# EAGLE design FE1-1S (EAGLE 8.5.2)
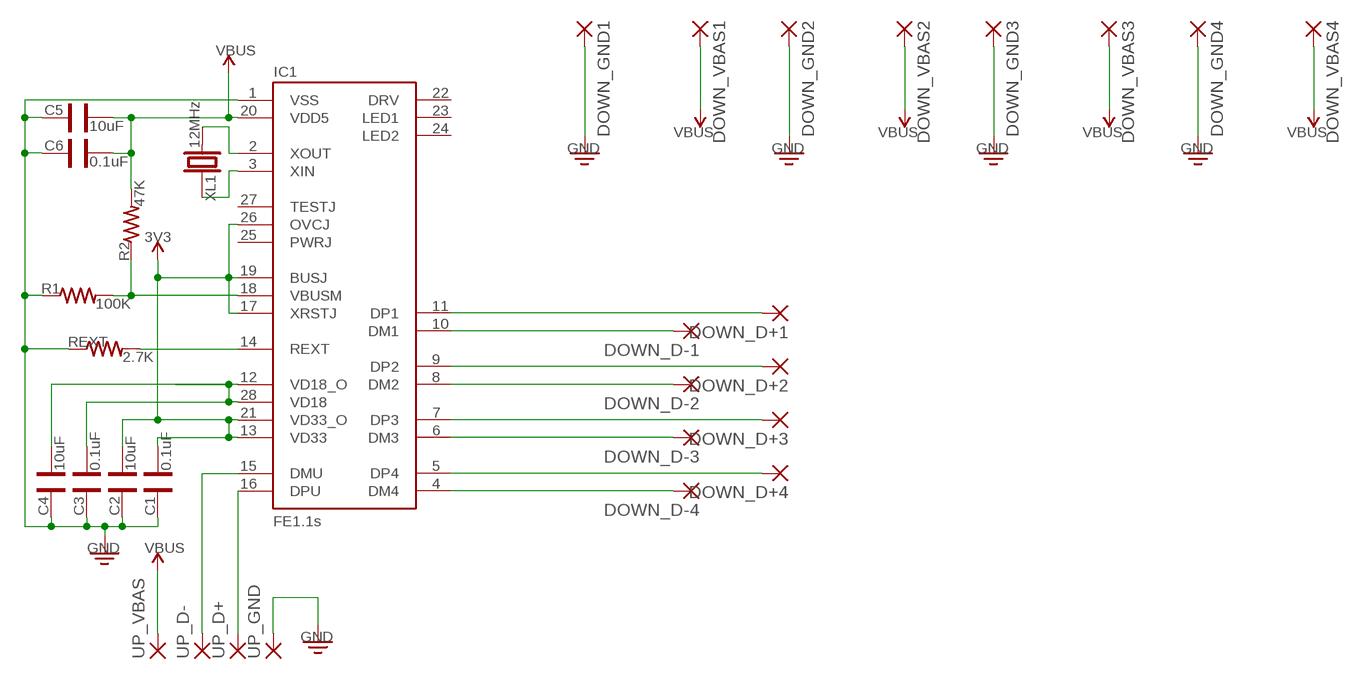
[diagram p0: schematic, sheet 1]

## Parts
C1  0.1uF  CAP0603  [CAP-0603]
C2  10uF  CAP0603  [CAP-0603]
C3  0.1uF  CAP0603  [CAP-0603]
C4  10uF  CAP0603  [CAP-0603]
C5  10uF  CAP0603  [CAP-0603]
C6  0.1uF  CAP0603  [CAP-0603]
DOWN_D+1  SMD2  [SMD1,27-2,54]
DOWN_D+2  SMD2  [SMD1,27-2,54]
DOWN_D+3  SMD2  [SMD1,27-2,54]
DOWN_D+4  SMD2  [SMD1,27-2,54]
DOWN_D-1  SMD2  [SMD1,27-2,54]
DOWN_D-2  SMD2  [SMD1,27-2,54]
DOWN_D-3  SMD2  [SMD1,27-2,54]
DOWN_D-4  SMD2  [SMD1,27-2,54]
DOWN_GND1  SMD2  [SMD1,27-2,54]
DOWN_GND2  SMD2  [SMD1,27-2,54]
DOWN_GND3  SMD2  [SMD1,27-2,54]
DOWN_GND4  SMD2  [SMD1,27-2,54]
DOWN_VBAS1  SMD2  [SMD1,27-2,54]
DOWN_VBAS2  SMD2  [SMD1,27-2,54]
DOWN_VBAS3  SMD2  [SMD1,27-2,54]
DOWN_VBAS4  SMD2  [SMD1,27-2,54]
IC1  FE1.1S  [FE1.1S_SSOP-28]
R1  100K  RES0603  [RES-0603]
R2  47K  RES0603  [RES-0603]
REXT  2.7K  RES0603  [RES-0603]
UP_D+  SMD2  [SMD1,27-2,54]
UP_D-  SMD2  [SMD1,27-2,54]
UP_GND  SMD2  [SMD1,27-2,54]
UP_VBAS  SMD2  [SMD1,27-2,54]
XL1  12MHz  CRYSTALHC49S  [HC49S]

## Nets
3V3: C1.1 C2.1 IC1.13(VD33) IC1.17(XRSTJ) IC1.19(BUSJ) IC1.21(VD33_O) IC1.26(OVCJ)
DD+1: DOWN_D+1.1(P) IC1.11(DP1)
DD+2: DOWN_D+2.1(P) IC1.9(DP2)
DD+3: DOWN_D+3.1(P) IC1.7(DP3)
DD+4: DOWN_D+4.1(P) IC1.5(DP4)
DD-1: DOWN_D-1.1(P) IC1.10(DM1)
DD-2: DOWN_D-2.1(P) IC1.8(DM2)
DD-3: DOWN_D-3.1(P) IC1.6(DM3)
DD-4: DOWN_D-4.1(P) IC1.4(DM4)
GND: C1.2 C2.2 C3.2 C4.2 C5.2 C6.2 DOWN_GND1.1(P) DOWN_GND2.1(P) DOWN_GND3.1(P) DOWN_GND4.1(P) IC1.1(VSS) R1.1 REXT.1 UP_GND.1(P)
N$1: IC1.14(REXT) REXT.2
N$2: IC1.15(DMU) UP_D-.1(P)
N$3: IC1.16(DPU) UP_D+.1(P)
N$7: IC1.2(XOUT) XL1.2
N$8: C3.1 C4.1 IC1.12(VD18_O) IC1.28(VD18)
N$9: IC1.3(XIN) XL1.1
N$13: IC1.18(VBUSM) R1.2 R2.1
VBUS: C5.1 C6.1 DOWN_VBAS1.1(P) DOWN_VBAS2.1(P) DOWN_VBAS3.1(P) DOWN_VBAS4.1(P) IC1.20(VDD5) R2.2 UP_VBAS.1(P)
Unconnected: IC1.22(DRV) IC1.23(LED1) IC1.24(LED2) IC1.25(PWRJ) IC1.27(TESTJ)

## Library data of the parts
C1-C6 = Ai_Passives:CAP
DOWN_D+1-DOWN_D+4 DOWN_D-1-DOWN_D-4 DOWN_GND1-DOWN_GND4 DOWN_VBAS1-DOWN_VBAS4 UP_D+ UP_D- UP_GND UP_VBAS = wirepad:SMD2: SMD PAD
IC1 = Ai_IC:FE1.1S
R1 R2 REXT = Ai_Passives:RES: Part # blah Digikey
XL1 = Ai_FrequencyControl:CRYSTAL: PTH: ... SMD: ... Cylinder: CMR200T-32.768KDZBT

## Board
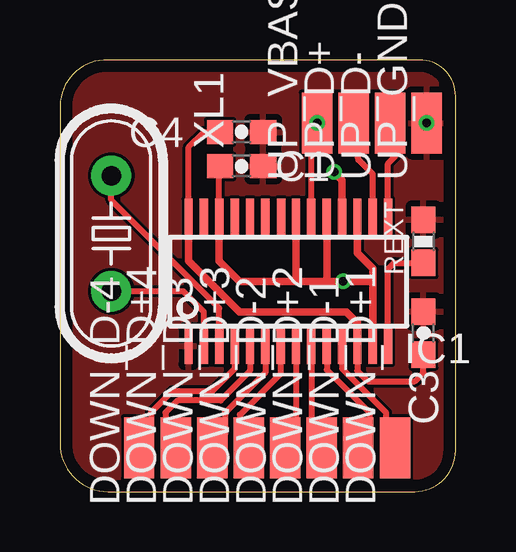
[diagram p1: board, top side]
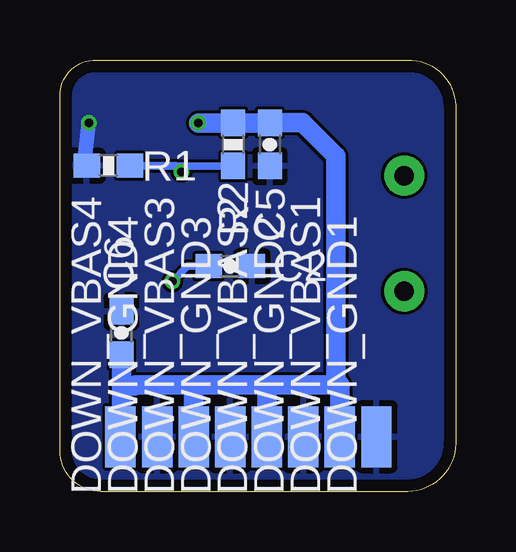
[diagram p2: board, bottom side, seen from below]

Size 16.5 x 18 mm. Coordinates in mm from the lower left corner, seen from the top.
Outline: 0,2 arc90 2,0 14.8,0 arc90 16.5,1.7 16.5,16.5 arc90 15,18 2,18 arc90 0,16.1 0,2
Copper layers (1*16): Top 0.035mm / dielectric 1.53mm / Bottom 0.035mm
Design rules "pban_5mil-l2": minimum track width 5mil, minimum drill 0.3mm, track to track 5mil, track to pad 0.229mm, pad to pad 5mil, via to via 5mil, smd to smd 5mil, copper to edge 0.5mm, drill to drill 0.5mm, minimum pad ring 0.15mm, minimum via ring 0.15mm, stop-mask expansion 4mil, vias tented up to drill 0.35mm, thermal gap 10mil

### Footprints (pad centres in the part's own frame; a part is rotated, then mirrored left to right if it is on the bottom)
CAP-0603 = smd 1.1 x 1: 1 -0.9,0; 2 0.9,0
SMD1,27-2,54 = smd 1.27 x 2.54: 1 0,0
FE1.1S_SSOP-28 = smd 0.35 x 1.5: 1 -4.16,-2.7; 2 -3.52,-2.7; 3 -2.88,-2.7; 4 -2.24,-2.7; 5 -1.6,-2.7; 6 -0.96,-2.7; 7 -0.32,-2.7; 8 0.32,-2.7; 9 0.96,-2.7; 10 1.6,-2.7; 11 2.24,-2.7; 12 2.88,-2.7; 13 3.52,-2.7; 14 4.16,-2.7; 15 4.16,2.7; 16 3.52,2.7; 17 2.88,2.7; 18 2.24,2.7; 19 1.6,2.7; 20 0.96,2.7; 21 0.32,2.7; 22 -0.3,2.7; 23 -0.96,2.7; 24 -1.6,2.7; 25 -2.24,2.7; 26 -2.88,2.7; 27 -3.52,2.7; 28 -4.16,2.7
RES-0603 = smd 1.1 x 1: 1 -0.9,0; 2 0.9,0
HC49S = drill 0.813 pad 1.676: 1 -2.413,0; 2 2.413,0

### Placement (x,y rotation side)
C1  7.58,13.57 0 top
C2  9.4,9.4 0 bottom
C3  15.16,6.61 90 top
C4  7.58,14.99 0 top
C5  7.75,14.48 270 bottom
C6  13.93,6.61 90 bottom
DOWN_D+1  13.97,1.82 0 top
DOWN_D+2  10.92,1.82 0 top
DOWN_D+3  7.87,1.82 0 top
DOWN_D+4  4.83,1.82 0 top
DOWN_D-1  12.45,1.82 0 top
DOWN_D-2  9.4,1.82 0 top
DOWN_D-3  6.35,1.82 0 top
DOWN_D-4  3.3,1.82 0 top
DOWN_GND1  3.3,2.29 0 bottom
DOWN_GND2  6.35,2.29 0 bottom
DOWN_GND3  9.4,2.29 0 bottom
DOWN_GND4  12.45,2.29 0 bottom
DOWN_VBAS1  4.83,2.29 0 bottom
DOWN_VBAS2  7.87,2.29 0 bottom
DOWN_VBAS3  10.92,2.29 0 bottom
DOWN_VBAS4  13.97,2.29 0 bottom
IC1  9.53,8.76 0 top
R1  14.48,13.59 0 bottom
R2  9.27,14.48 90 bottom
REXT  15.16,10.44 270 top
UP_D+  12.25,15.37 0 top
UP_D-  13.77,15.37 0 top
UP_GND  15.29,15.37 0 top
UP_VBAS  10.72,15.37 0 top
XL1  2.14,10.76 270 top

### Tracks (layer width: path | path; a pad name or v marks a point on that pad's centre or on a via)
3V3  (via drill 0.35)
  Top 0.254: IC1.26 6.64,13.14 C1.1
  Top 0.305: IC1.13 13.04,8.76 | 13.04,8.76 13.04,9.31 12.4,9.95 IC1.17 | IC1.26 6.64,9.61 7.49,8.76 9.91,8.76 | 9.91,8.76 11.18,8.76 | 11.18,8.76 v11.81,8.76 13.04,8.76 | IC1.21 9.85,8.82 9.91,8.76 | IC1.19 11.12,8.81 11.18,8.76
  Bottom 0.305: C2.1 11.18,9.4 v11.81,8.76
DD+1
  Top 0.254: IC1.11 11.77,5.13 13.6,3.3 13.6,2.19 DOWN_D+1.1
DD+2
  Top 0.254: IC1.9 10.48,2.26 DOWN_D+2.1
DD+3
  Top 0.254: IC1.7 9.21,4.91 7.5,3.2 7.5,2.2 DOWN_D+3.1
DD+4
  Top 0.254: IC1.5 7.92,5.03 6.7,3.8 4.9,3.8 4.4,3.3 4.4,2.25 DOWN_D+4.1
DD-1
  Top 0.254: IC1.10 11.12,5.08 12.9,3.3 12.9,2.28 DOWN_D-1.1
DD-2
  Top 0.254: IC1.8 9.85,2.27 DOWN_D-2.1
DD-3
  Top 0.254: IC1.6 8.56,4.96 6.88,3.28 6.88,2.36 DOWN_D-3.1
DD-4
  Top 0.254: IC1.4 7.29,5.12 6.34,4.18 4.68,4.18 3.8,3.3 3.8,2.32 DOWN_D-4.1
GND  (via drill 0.35)
  Bottom 0.61: UP_GND.1 15.49,13.71 R1.1
  other vias: 15.29,15.37
  pour Top: -3.81,-3.81 -3.81,22.86 21.59,22.86 25.4,22.86 25.4,-5.08 -3.81,-5.08
  pour Bottom: -2.54,-5.08 24.13,-5.08 24.13,22.86 -2.54,22.86
N$1
  Top 0.254: IC1.14 13.69,9.29 13.94,9.54 REXT.2
N$2
  Top 0.254: IC1.15 13.69,13.69 13.97,13.97 UP_D-.1
N$3
  Top 0.254: IC1.16 13.04,13.24 12.45,13.84 UP_D+.1
N$7
  Top 0.254: IC1.2 6,7.5 5.15,8.35 XL1.2
N$8
  Top 0.254: IC1.28 5.37,14.37 6,15 6.01,14.99 C4.1 | IC1.12 12.4,5.03 12.84,4.6 14.8,4.6 15.16,4.96 C3.1
  Top 0.305: IC1.28 5.37,9.62 7.49,7.49 11.94,7.49 12.32,7.11 arc-90 12.4,7.03 IC1.12
N$9
  Top 0.254: IC1.3 6.64,7.66 2.14,12.16 XL1.1
N$13  (via drill 0.35)
  Top 0.305: IC1.18 11.77,13 v11.43,13.34
  Bottom 0.305: v11.43,13.34 11.68,13.59 13.46,13.59 | 13.46,13.59 R1.2 | R2.1 13.45,13.58 13.46,13.59
VBUS  (via drill 0.35)
  Top 0.254: IC1.20 10.48,14.93 UP_VBAS.1
  Bottom 0.813: 10.92,4.45 13.34,4.45 13.38,4.4 13.93,4.4 | 10.92,4.45 7.87,4.45 | 7.87,4.45 4.83,4.45 | DOWN_VBAS1.1 4.83,4.45 | DOWN_VBAS2.1 7.87,4.45 | DOWN_VBAS3.1 10.92,4.45 | R2.2 9.28,15.37 UP_VBAS.1 7.76,15.37 C5.1 6.38,15.38 5,14 5,4.62 4.83,4.45 | C6.1 13.93,4.4 | 13.93,4.4 13.93,2.33 DOWN_VBAS4.1
  other vias: 10.72,15.37